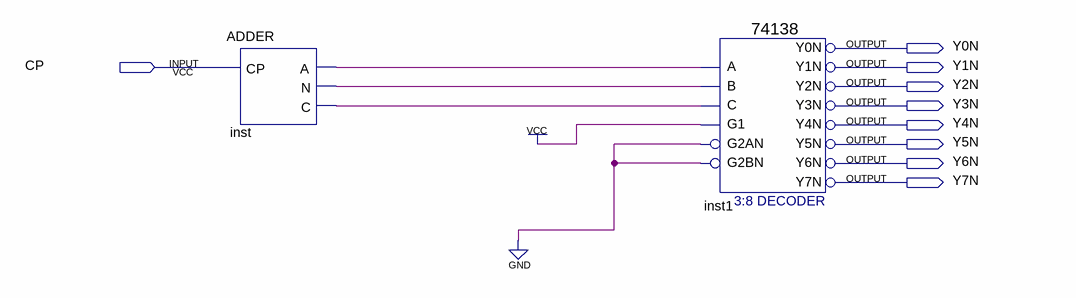
[diagram p0: schematic sheet]
// Quartus schematic Block2.bdf as structural Verilog: 2 symbols, 9 pins
module Block2 (
  input  CP,
  output Y0N,
  output Y1N,
  output Y2N,
  output Y3N,
  output Y4N,
  output Y5N,
  output Y6N,
  output Y7N
);

  wire inst_a, inst_c, inst_n;

  ADDER inst (.CP(CP), .A(inst_a), .N(inst_n), .C(inst_c));
  \74138  inst1 (
    .A(inst_a), .B(inst_n), .G1(1'b1), .C(inst_c), .G2AN(1'b0), .G2BN(1'b0), .Y0N(Y0N), .Y1N(Y1N), .Y2N(Y2N),
    .Y3N(Y3N), .Y4N(Y4N), .Y5N(Y5N), .Y6N(Y6N), .Y7N(Y7N));
endmodule
